# EAGLE design sensor_board (EAGLE 8.1.0)
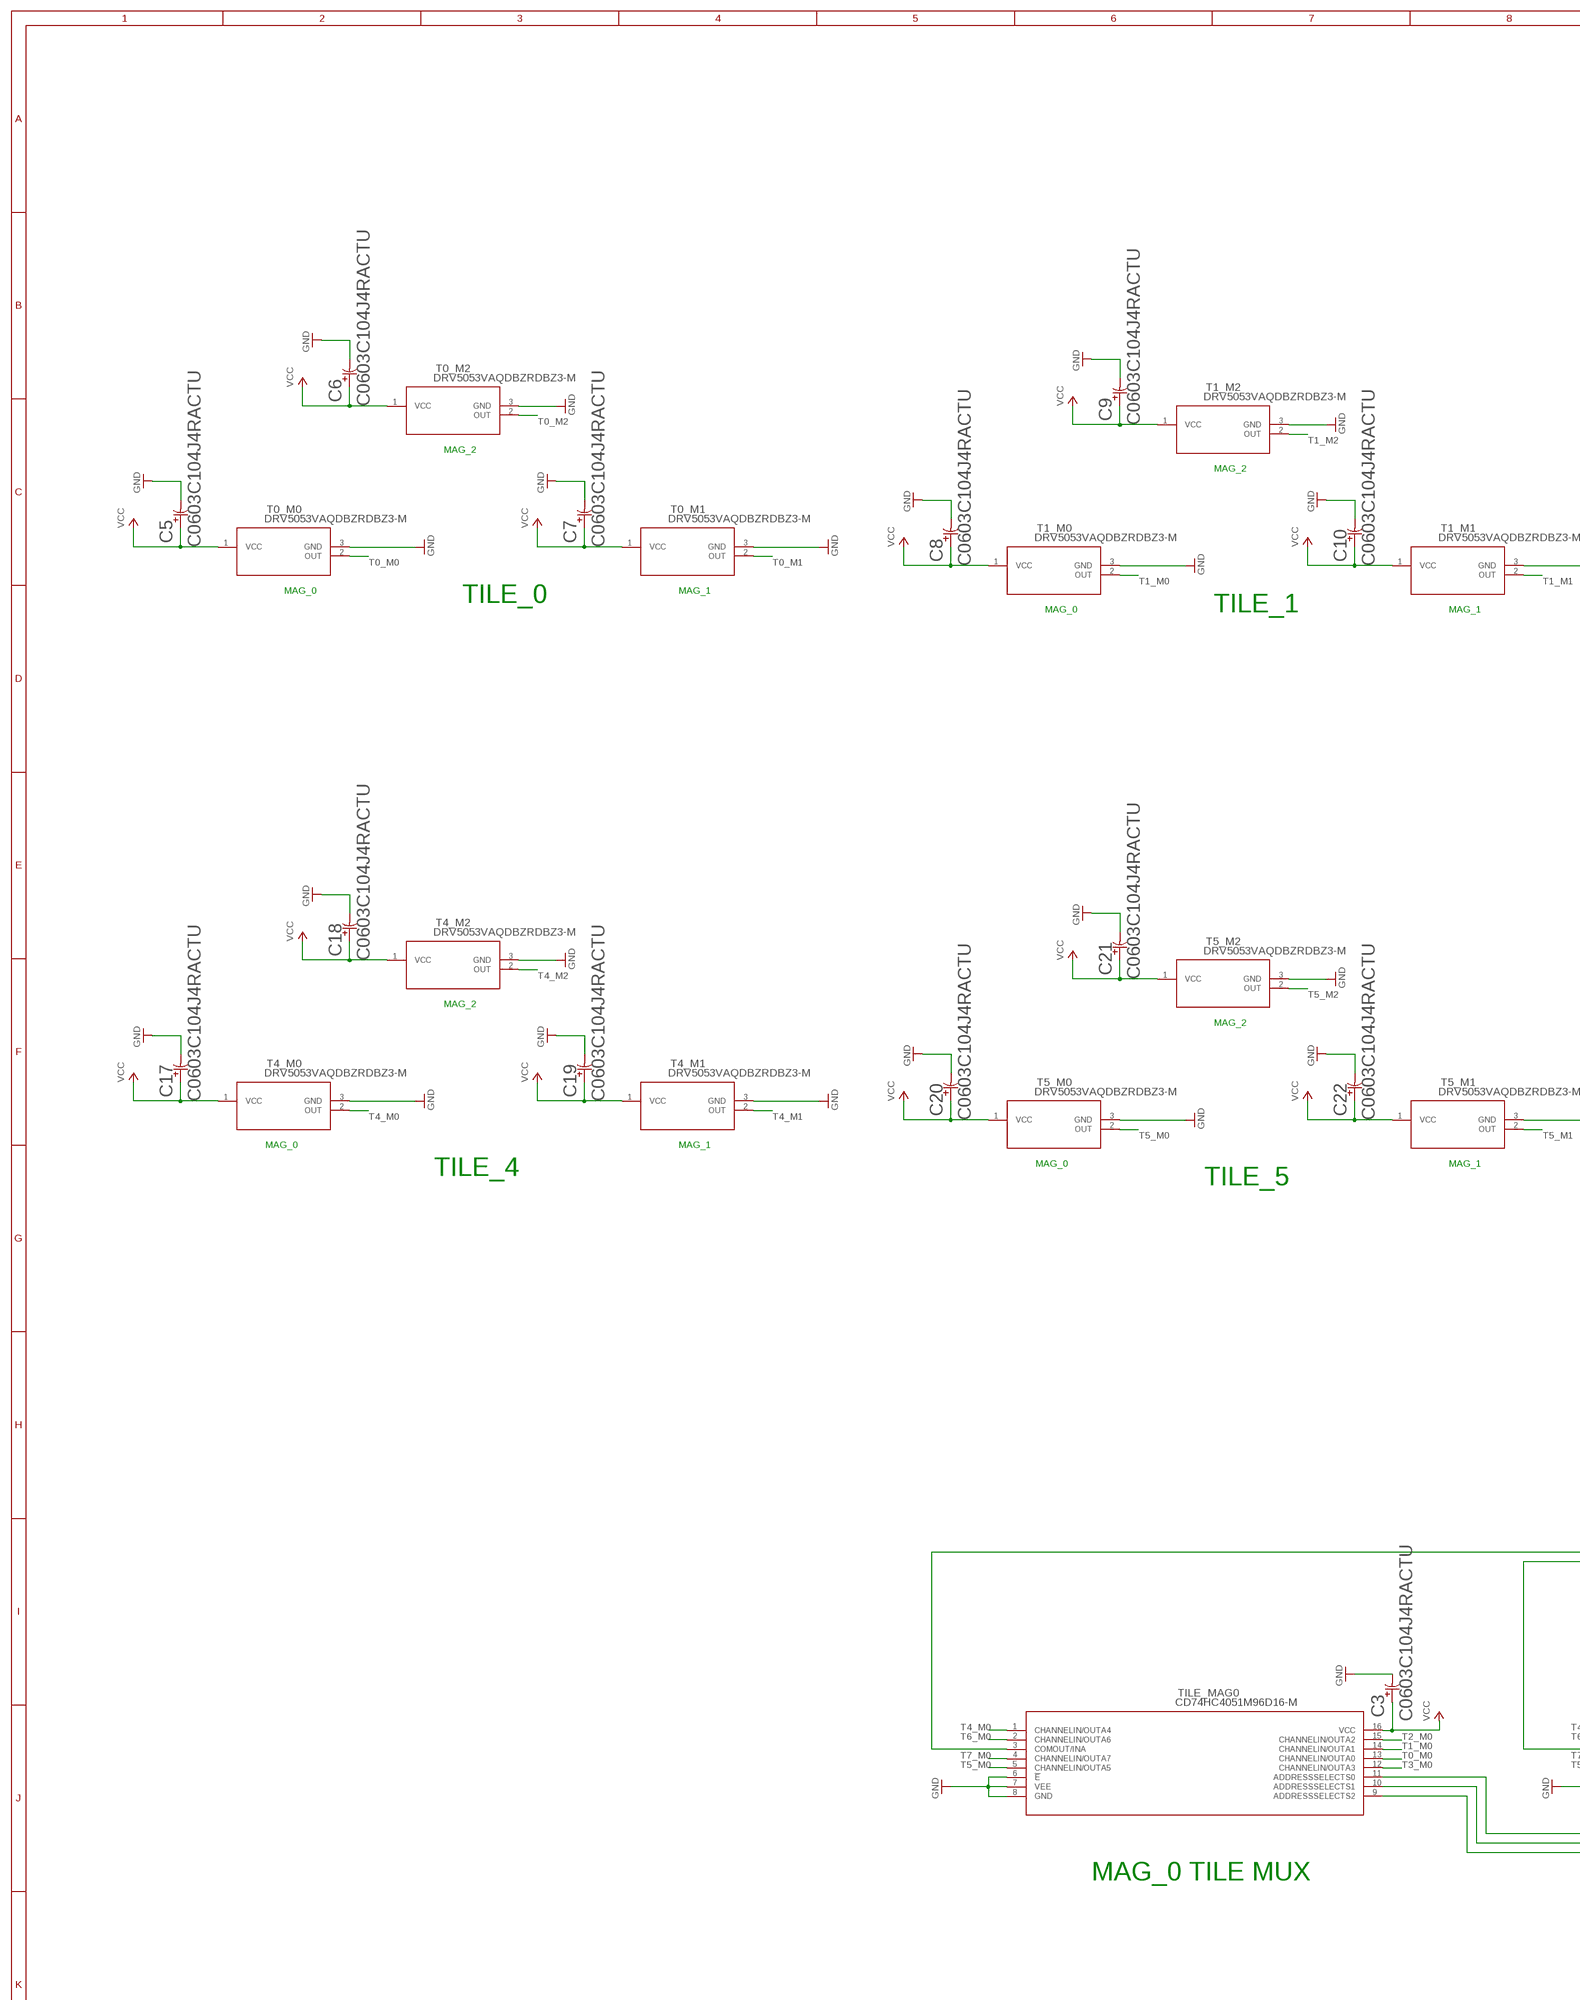
[diagram p0: schematic, sheet 1, part 1 of 3]
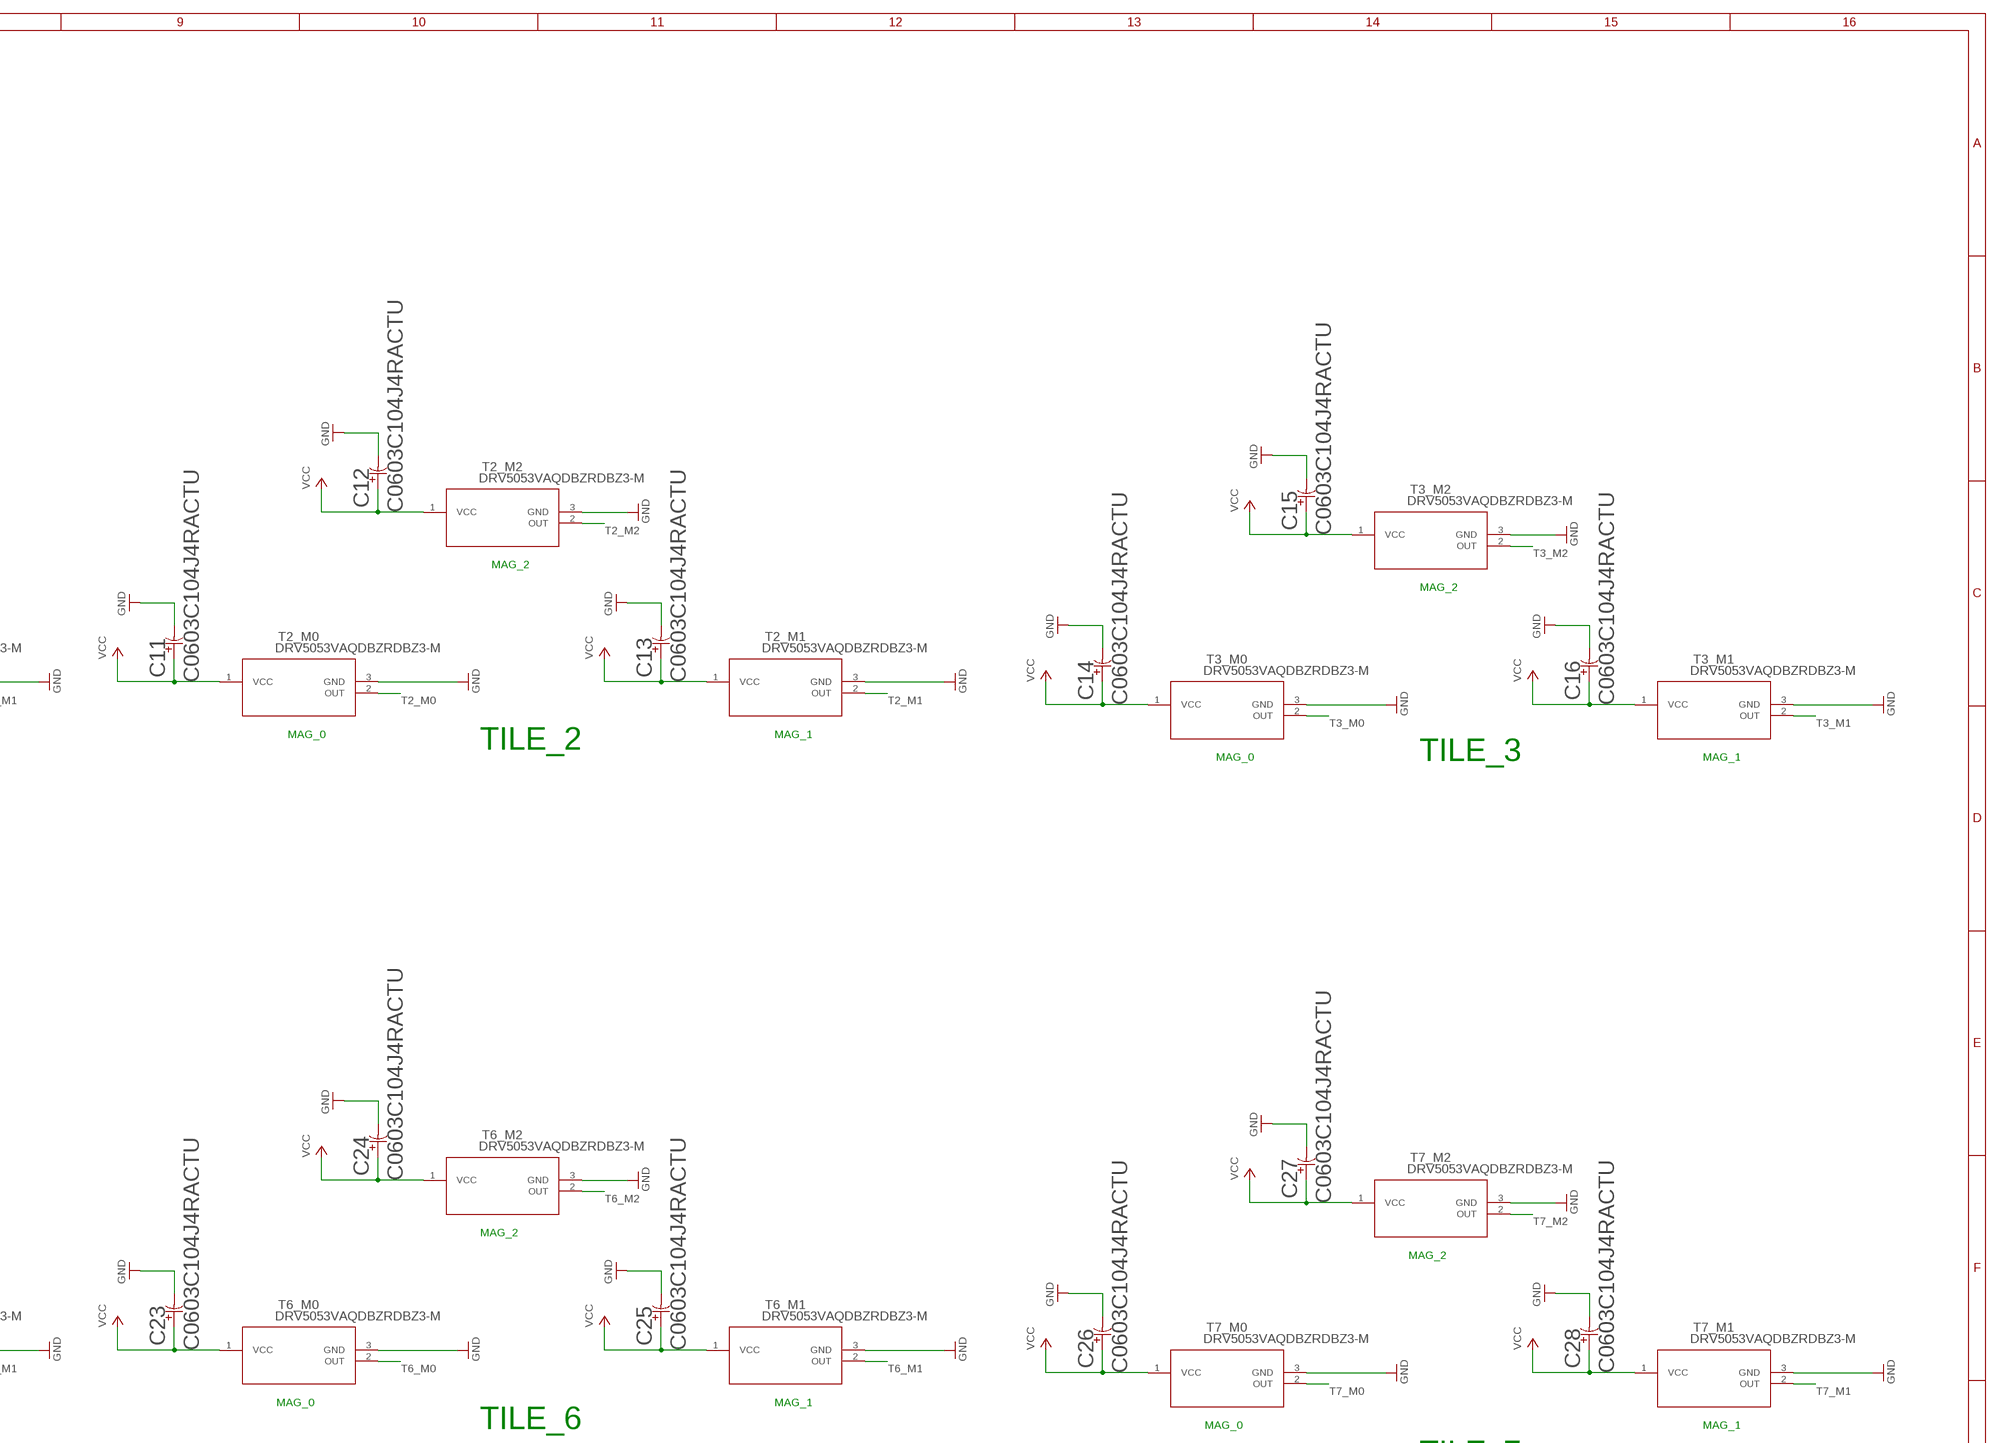
[diagram p1: schematic, sheet 1, part 2 of 3]
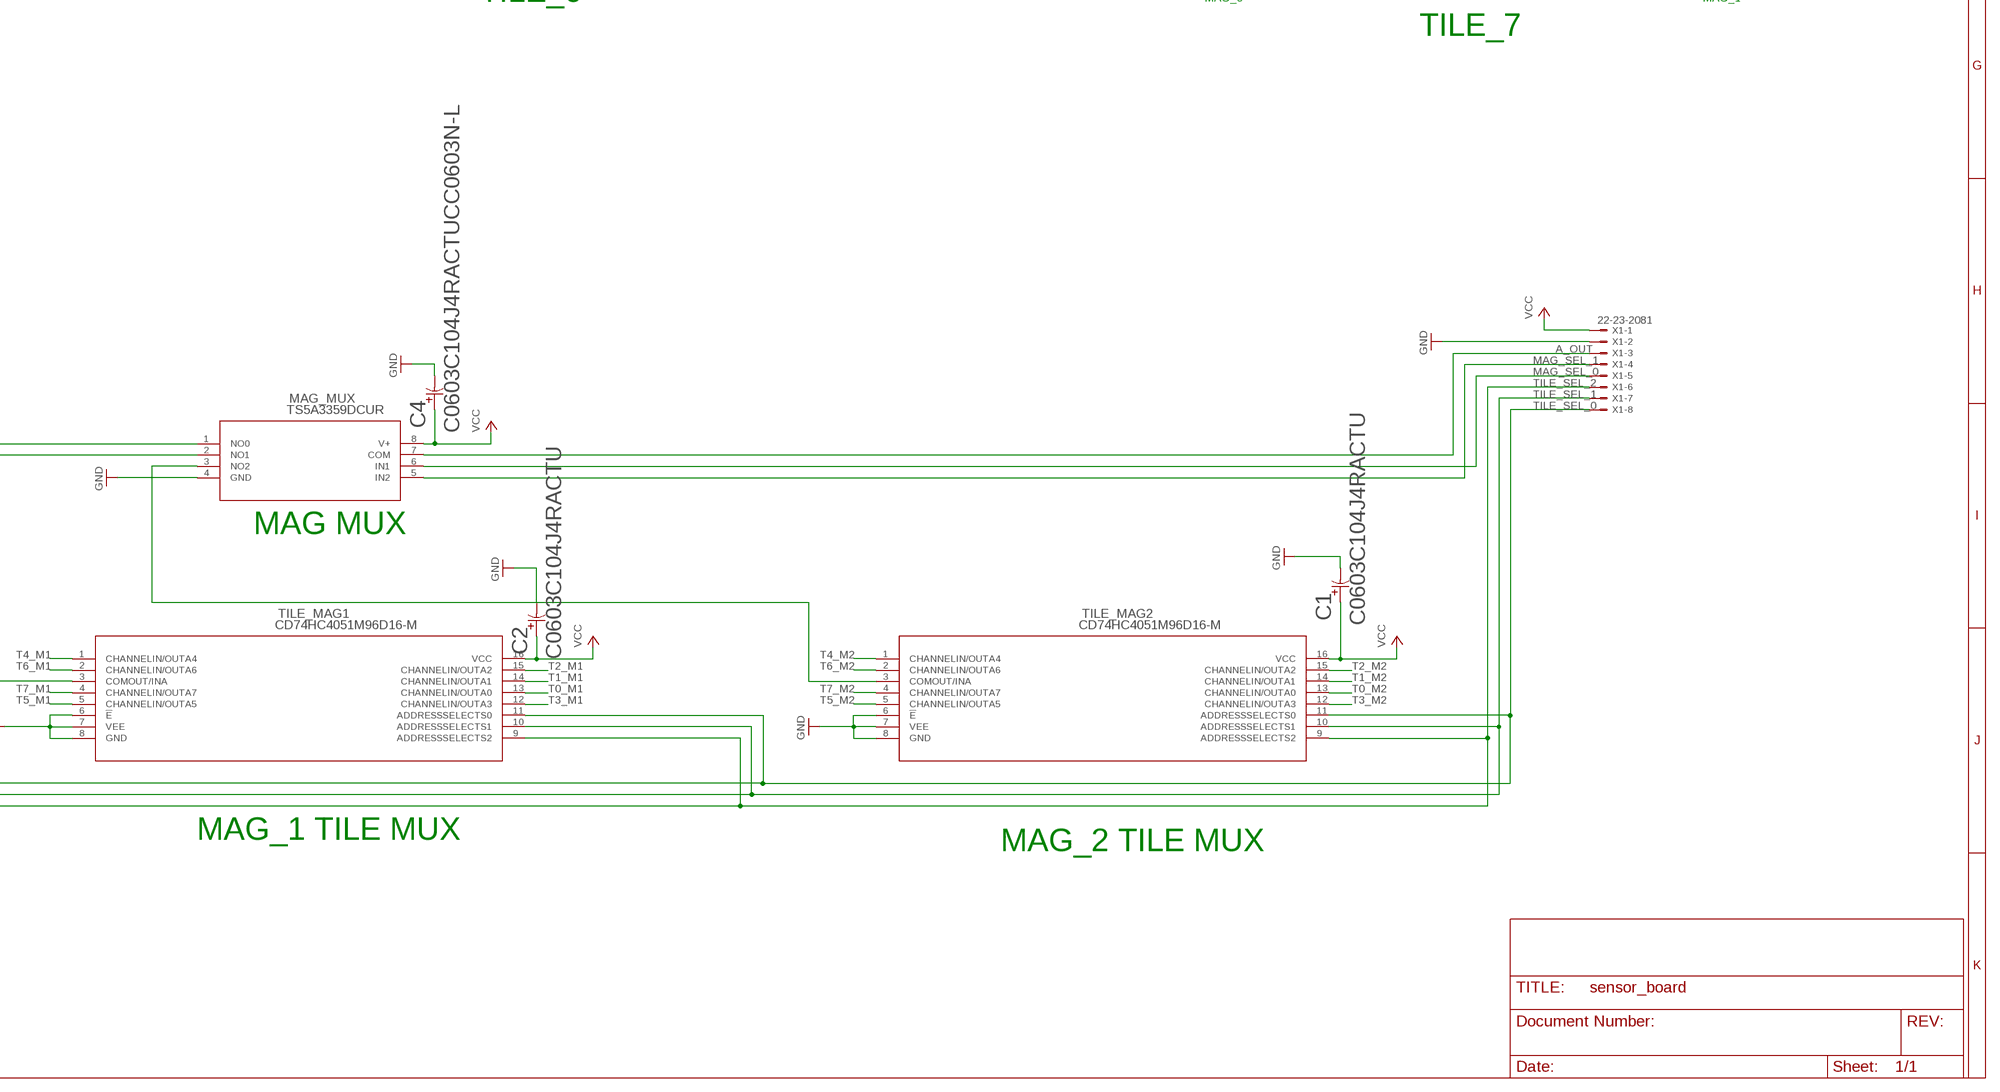
[diagram p2: schematic, sheet 1, part 3 of 3]

## Parts
C1  C0603C104J4RACTU  [CC0603N]
C2  C0603C104J4RACTU  [CC0603N]
C3  C0603C104J4RACTU  [CC0603N]
C4  C0603C104J4RACTUCC0603N-L  [CC0603N-L]
C5  C0603C104J4RACTU  [CC0603N]
C6  C0603C104J4RACTU  [CC0603N]
C7  C0603C104J4RACTU  [CC0603N]
C8  C0603C104J4RACTU  [CC0603N]
C9  C0603C104J4RACTU  [CC0603N]
C10  C0603C104J4RACTU  [CC0603N]
C11  C0603C104J4RACTU  [CC0603N]
C12  C0603C104J4RACTU  [CC0603N]
C13  C0603C104J4RACTU  [CC0603N]
C14  C0603C104J4RACTU  [CC0603N]
C15  C0603C104J4RACTU  [CC0603N]
C16  C0603C104J4RACTU  [CC0603N]
C17  C0603C104J4RACTU  [CC0603N]
C18  C0603C104J4RACTU  [CC0603N]
C19  C0603C104J4RACTU  [CC0603N]
C20  C0603C104J4RACTU  [CC0603N]
C21  C0603C104J4RACTU  [CC0603N]
C22  C0603C104J4RACTU  [CC0603N]
C23  C0603C104J4RACTU  [CC0603N]
C24  C0603C104J4RACTU  [CC0603N]
C25  C0603C104J4RACTU  [CC0603N]
C26  C0603C104J4RACTU  [CC0603N]
C27  C0603C104J4RACTU  [CC0603N]
C28  C0603C104J4RACTU  [CC0603N]
MAG_MUX  TS5A3359DCUR  [DCU8]
T0_M0  DRV5053VAQDBZRDBZ3-M  [DBZ3-M]
T0_M1  DRV5053VAQDBZRDBZ3-M  [DBZ3-M]
T0_M2  DRV5053VAQDBZRDBZ3-M  [DBZ3-M]
T1_M0  DRV5053VAQDBZRDBZ3-M  [DBZ3-M]
T1_M1  DRV5053VAQDBZRDBZ3-M  [DBZ3-M]
T1_M2  DRV5053VAQDBZRDBZ3-M  [DBZ3-M]
T2_M0  DRV5053VAQDBZRDBZ3-M  [DBZ3-M]
T2_M1  DRV5053VAQDBZRDBZ3-M  [DBZ3-M]
T2_M2  DRV5053VAQDBZRDBZ3-M  [DBZ3-M]
T3_M0  DRV5053VAQDBZRDBZ3-M  [DBZ3-M]
T3_M1  DRV5053VAQDBZRDBZ3-M  [DBZ3-M]
T3_M2  DRV5053VAQDBZRDBZ3-M  [DBZ3-M]
T4_M0  DRV5053VAQDBZRDBZ3-M  [DBZ3-M]
T4_M1  DRV5053VAQDBZRDBZ3-M  [DBZ3-M]
T4_M2  DRV5053VAQDBZRDBZ3-M  [DBZ3-M]
T5_M0  DRV5053VAQDBZRDBZ3-M  [DBZ3-M]
T5_M1  DRV5053VAQDBZRDBZ3-M  [DBZ3-M]
T5_M2  DRV5053VAQDBZRDBZ3-M  [DBZ3-M]
T6_M0  DRV5053VAQDBZRDBZ3-M  [DBZ3-M]
T6_M1  DRV5053VAQDBZRDBZ3-M  [DBZ3-M]
T6_M2  DRV5053VAQDBZRDBZ3-M  [DBZ3-M]
T7_M0  DRV5053VAQDBZRDBZ3-M  [DBZ3-M]
T7_M1  DRV5053VAQDBZRDBZ3-M  [DBZ3-M]
T7_M2  DRV5053VAQDBZRDBZ3-M  [DBZ3-M]
TILE_MAG0  CD74HC4051M96D16-M  [D16-M]
TILE_MAG1  CD74HC4051M96D16-M  [D16-M]
TILE_MAG2  CD74HC4051M96D16-M  [D16-M]
X1  22-23-2081  [22-23-2081]

## Nets
A_OUT: MAG_MUX.7(COM) X1.3
GND: C1.2 C2.2 C3.2 C4.2 C5.2 C6.2 C7.2 C8.2 C9.2 C10.2 C11.2 C12.2 C13.2 C14.2 C15.2 C16.2 C17.2 C18.2 C19.2 C20.2 C21.2 C22.2 C23.2 C24.2 C25.2 C26.2 C27.2 C28.2 MAG_MUX.4(GND) T0_M0.3(GND) T0_M1.3(GND) T0_M2.3(GND) T1_M0.3(GND) T1_M1.3(GND) T1_M2.3(GND) T2_M0.3(GND) T2_M1.3(GND) T2_M2.3(GND) T3_M0.3(GND) T3_M1.3(GND) T3_M2.3(GND) T4_M0.3(GND) T4_M1.3(GND) T4_M2.3(GND) T5_M0.3(GND) T5_M1.3(GND) T5_M2.3(GND) T6_M0.3(GND) T6_M1.3(GND) T6_M2.3(GND) T7_M0.3(GND) T7_M1.3(GND) T7_M2.3(GND) TILE_MAG0.6(!E) TILE_MAG0.7(VEE) TILE_MAG0.8(GND) TILE_MAG1.6(!E) TILE_MAG1.7(VEE) TILE_MAG1.8(GND) TILE_MAG2.6(!E) TILE_MAG2.7(VEE) TILE_MAG2.8(GND) X1.2
MAG_SEL_0: MAG_MUX.6(IN1) X1.5
MAG_SEL_1: MAG_MUX.5(IN2) X1.4
N$1: MAG_MUX.1(NO0) TILE_MAG0.3(COMOUT/INA)
N$2: MAG_MUX.2(NO1) TILE_MAG1.3(COMOUT/INA)
N$3: MAG_MUX.3(NO2) TILE_MAG2.3(COMOUT/INA)
T0_M0: T0_M0.2(OUT) TILE_MAG0.13(CHANNELIN/OUTA0)
T0_M1: T0_M1.2(OUT) TILE_MAG1.13(CHANNELIN/OUTA0)
T0_M2: T0_M2.2(OUT) TILE_MAG2.13(CHANNELIN/OUTA0)
T1_M0: T1_M0.2(OUT) TILE_MAG0.14(CHANNELIN/OUTA1)
T1_M1: T1_M1.2(OUT) TILE_MAG1.14(CHANNELIN/OUTA1)
T1_M2: T1_M2.2(OUT) TILE_MAG2.14(CHANNELIN/OUTA1)
T2_M0: T2_M0.2(OUT) TILE_MAG0.15(CHANNELIN/OUTA2)
T2_M1: T2_M1.2(OUT) TILE_MAG1.15(CHANNELIN/OUTA2)
T2_M2: T2_M2.2(OUT) TILE_MAG2.15(CHANNELIN/OUTA2)
T3_M0: T3_M0.2(OUT) TILE_MAG0.12(CHANNELIN/OUTA3)
T3_M1: T3_M1.2(OUT) TILE_MAG1.12(CHANNELIN/OUTA3)
T3_M2: T3_M2.2(OUT) TILE_MAG2.12(CHANNELIN/OUTA3)
T4_M0: T4_M0.2(OUT) TILE_MAG0.1(CHANNELIN/OUTA4)
T4_M1: T4_M1.2(OUT) TILE_MAG1.1(CHANNELIN/OUTA4)
T4_M2: T4_M2.2(OUT) TILE_MAG2.1(CHANNELIN/OUTA4)
T5_M0: T5_M0.2(OUT) TILE_MAG0.5(CHANNELIN/OUTA5)
T5_M1: T5_M1.2(OUT) TILE_MAG1.5(CHANNELIN/OUTA5)
T5_M2: T5_M2.2(OUT) TILE_MAG2.5(CHANNELIN/OUTA5)
T6_M0: T6_M0.2(OUT) TILE_MAG0.2(CHANNELIN/OUTA6)
T6_M1: T6_M1.2(OUT) TILE_MAG1.2(CHANNELIN/OUTA6)
T6_M2: T6_M2.2(OUT) TILE_MAG2.2(CHANNELIN/OUTA6)
T7_M0: T7_M0.2(OUT) TILE_MAG0.4(CHANNELIN/OUTA7)
T7_M1: T7_M1.2(OUT) TILE_MAG1.4(CHANNELIN/OUTA7)
T7_M2: T7_M2.2(OUT) TILE_MAG2.4(CHANNELIN/OUTA7)
TILE_SEL_0: TILE_MAG0.11(ADDRESSSELECTS0) TILE_MAG1.11(ADDRESSSELECTS0) TILE_MAG2.11(ADDRESSSELECTS0) X1.8
TILE_SEL_1: TILE_MAG0.10(ADDRESSSELECTS1) TILE_MAG1.10(ADDRESSSELECTS1) TILE_MAG2.10(ADDRESSSELECTS1) X1.7
TILE_SEL_2: TILE_MAG0.9(ADDRESSSELECTS2) TILE_MAG1.9(ADDRESSSELECTS2) TILE_MAG2.9(ADDRESSSELECTS2) X1.6
VCC: C1.1 C2.1 C3.1 C4.1 C5.1 C6.1 C7.1 C8.1 C9.1 C10.1 C11.1 C12.1 C13.1 C14.1 C15.1 C16.1 C17.1 C18.1 C19.1 C20.1 C21.1 C22.1 C23.1 C24.1 C25.1 C26.1 C27.1 C28.1 MAG_MUX.8(V+) T0_M0.1(VCC) T0_M1.1(VCC) T0_M2.1(VCC) T1_M0.1(VCC) T1_M1.1(VCC) T1_M2.1(VCC) T2_M0.1(VCC) T2_M1.1(VCC) T2_M2.1(VCC) T3_M0.1(VCC) T3_M1.1(VCC) T3_M2.1(VCC) T4_M0.1(VCC) T4_M1.1(VCC) T4_M2.1(VCC) T5_M0.1(VCC) T5_M1.1(VCC) T5_M2.1(VCC) T6_M0.1(VCC) T6_M1.1(VCC) T6_M2.1(VCC) T7_M0.1(VCC) T7_M1.1(VCC) T7_M2.1(VCC) TILE_MAG0.16(VCC) TILE_MAG1.16(VCC) TILE_MAG2.16(VCC) X1.1

## Notes on the sheet
- MAG_2
- MAG_2 | MAG_2
- MAG_2
- MAG_0 | MAG_1
- TILE_0
- MAG_0 | TILE_1 | MAG_1 | MAG_0 | MAG_1
- TILE_2
- MAG_0 | TILE_3 | MAG_1
- MAG_2
- MAG_2 | MAG_2
- MAG_2
- MAG_0 | MAG_1
- MAG_0 | MAG_1 | MAG_0 | MAG_1
- TILE_4
- TILE_5 | TILE_6 | MAG_0 | MAG_1
- TILE_7
- MAG MUX
- MAG_0 TILE MUX | MAG_1 TILE MUX
- MAG_2 TILE MUX

## Library data of the parts
C1-C28 = senior_project_01uf_cap:C0603C104J4RACTU; MANUFACTURER_PART_NUMBER: C0603C104J4RACTU; VENDOR: Kemet
MAG_MUX = senior_project_3-1_mux:TS5A3359DCUR; MANUFACTURER_PART_NUMBER: TS5A3359DCUR; VENDOR: Texas Instruments
T0_M0 T0_M1 T0_M2 T1_M0 T1_M1 T1_M2 T2_M0 T2_M1 T2_M2 T3_M0 T3_M1 T3_M2 T4_M0 T4_M1 T4_M2 T5_M0 T5_M1 T5_M2 T6_M0 T6_M1 T6_M2 T7_M0 T7_M1 T7_M2 = senior_project_hall-effect-sensor:DRV5053VAQDBZR; MANUFACTURER_PART_NUMBER: drv5053vaqdbzr; VENDOR: Texas Instruments
TILE_MAG0 TILE_MAG1 TILE_MAG2 = senior_proj_8-1_mux:CD74HC4051M96; MANUFACTURER_PART_NUMBER: CD74HC4051M96; VENDOR: Texas Instruments
X1 = con-molex:22-23-2081: .100" (2.54mm) Center Header - 8 Pin; MF: MOLEX; MPN: 22-23-2081; OC_FARNELL: 1756826; OC_NEWARK: 01C7592

## Board
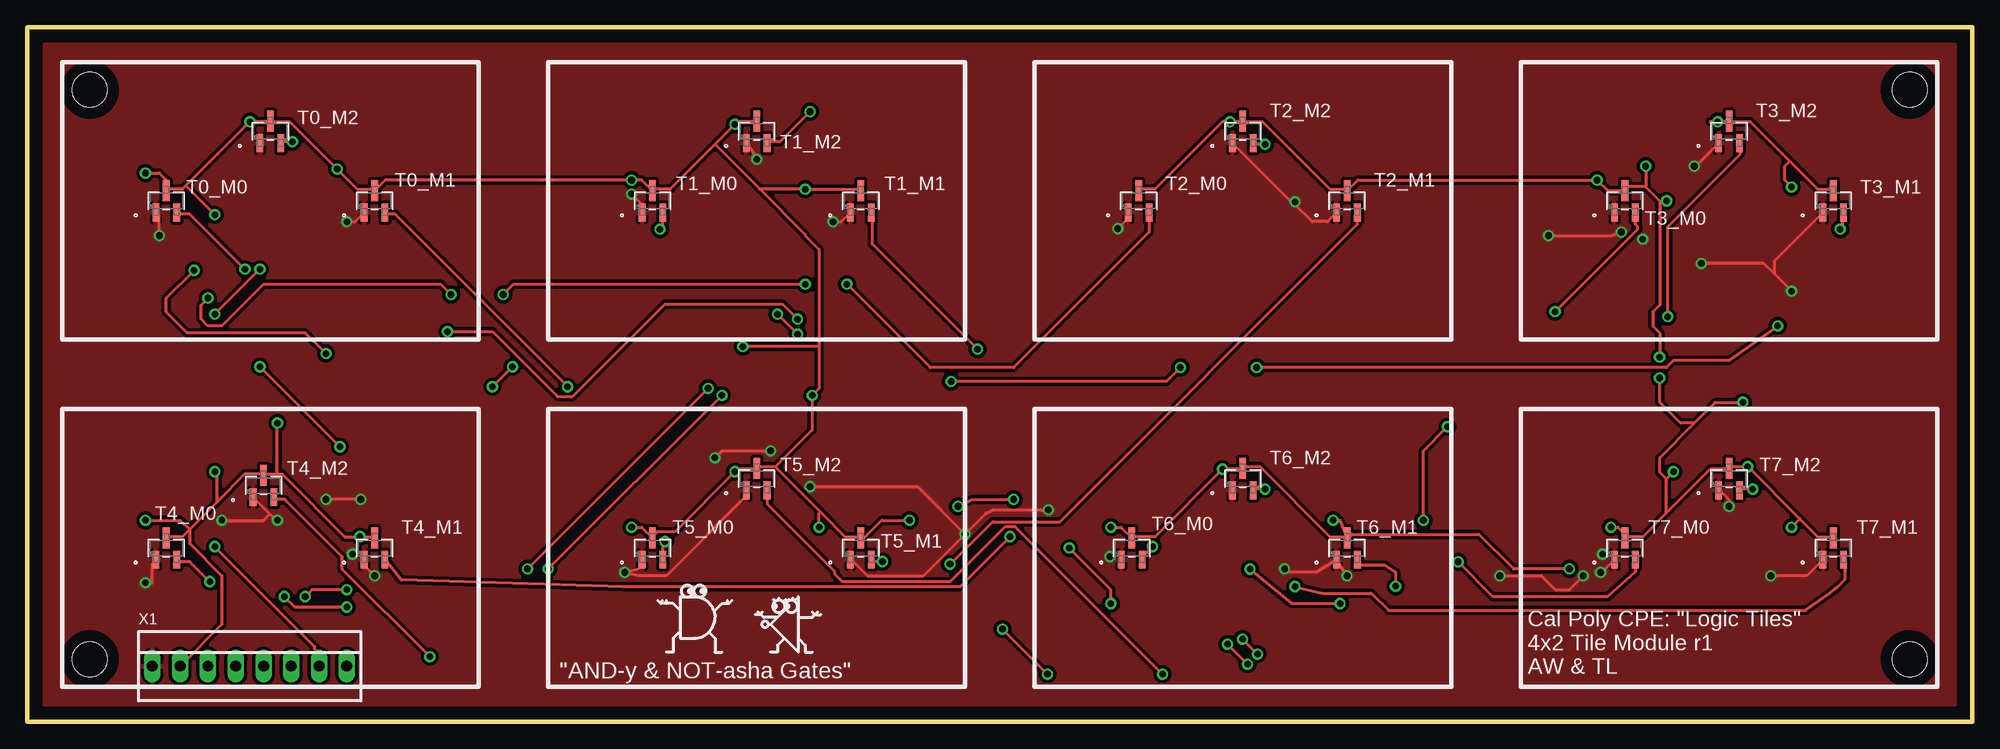
[diagram p3: board, top side]
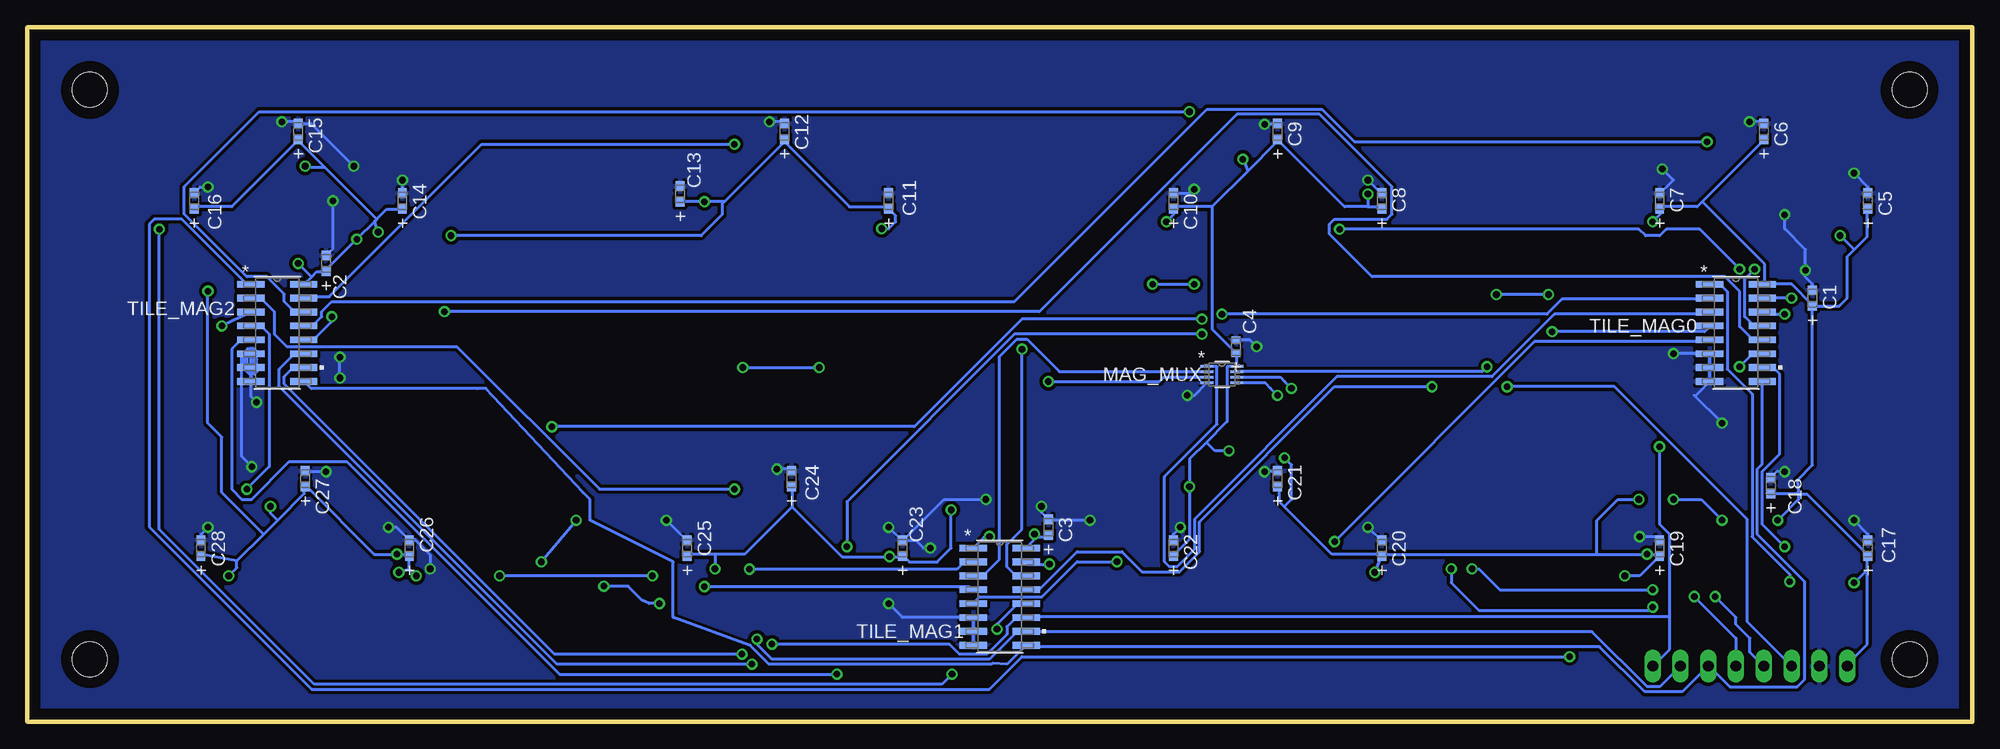
[diagram p4: board, bottom side, seen from below]

Size 177.8 x 63.5 mm. Coordinates in mm from the lower left corner, seen from the top.
Outline: 0,0 177.8,0 177.8,63.5 0,63.5 0,0
Copper layers (1*16): Top 0.035mm / dielectric 1.5mm / Bottom 0.035mm
Design rules "default": minimum track width 10mil, minimum drill 24mil, track to track 8mil, track to pad 8mil, pad to pad 8mil, via to via 8mil, smd to smd 8mil, copper to edge 40mil, drill to drill 8mil, minimum pad ring 10mil, minimum via ring 8mil, stop-mask expansion 4mil, vias tented up to drill 0mil, thermal gap 10mil
Holes 3.2 mm at 5.71,57.78 5.71,5.71 172.09,57.78 172.09,5.71

### Footprints (pad centres in the part's own frame; a part is rotated, then mirrored left to right if it is on the bottom)
CC0603N = smd 0.864 x 0.813: 1 -0.724,0; 2 0.724,0
CC0603N-L = smd 0.66 x 0.813: 1 -0.622,0; 2 0.622,0
DCU8 = smd 1.168 x 0.254: 1 -1.372,0.75; 2 -1.372,0.25; 3 -1.372,-0.25; 4 -1.372,-0.75; 5 1.372,-0.75; 6 1.372,-0.25; 7 1.372,0.25; 8 1.372,0.75
DBZ3-M = smd 0.61 x 1.626: 1 -0.95,-1.067; 2 0.95,-1.067 | smd 0.61 x 1.892: 3 0,0.933
D16-M = smd 2.489 x 0.61: 1 -2.413,4.445; 2 -2.413,3.175; 3 -2.413,1.905; 4 -2.413,0.635; 5 -2.413,-0.635; 6 -2.413,-1.905; 7 -2.413,-3.175; 8 -2.413,-4.445; 9 2.413,-4.445; 10 2.413,-3.175; 11 2.413,-1.905; 12 2.413,-0.635; 13 2.413,0.635; 14 2.413,1.905; 15 2.413,3.175; 16 2.413,4.445
22-23-2081 = drill 1 long: 1 -8.89,0; 2 -6.35,0; 3 -3.81,0; 4 -1.27,0; 5 1.27,0; 6 3.81,0; 7 6.35,0; 8 8.89,0

### Placement (x,y rotation side)
C1  14.61,38.73 90 bottom
C2  150.5,41.91 90 bottom
C3  84.45,17.78 90 bottom
C4  67.31,34.29 90 bottom
C5  9.53,47.62 90 bottom
C6  19.05,53.98 90 bottom
C7  28.57,47.62 90 bottom
C8  53.98,47.62 90 bottom
C9  63.5,53.98 90 bottom
C10  73.03,47.62 90 bottom
C11  99.06,47.62 90 bottom
C12  108.58,53.98 90 bottom
C13  118.11,48.26 90 bottom
C14  143.51,47.62 90 bottom
C15  153.03,53.98 90 bottom
C16  162.56,47.62 90 bottom
C17  9.53,15.88 90 bottom
C18  18.41,21.59 90 bottom
C19  28.57,15.88 90 bottom
C20  53.98,15.88 90 bottom
C21  63.5,22.23 90 bottom
C22  73.03,15.88 90 bottom
C23  97.79,15.88 90 bottom
C24  107.95,22.23 90 bottom
C25  117.47,15.88 90 bottom
C26  142.88,15.88 90 bottom
C27  152.4,22.23 90 bottom
C28  161.93,15.88 90 bottom
MAG_MUX  68.58,31.75 0 bottom
T0_M0  12.7,47.62 0 top
T0_M1  31.75,47.62 0 top
T0_M2  22.23,53.98 0 top
T1_M0  57.15,47.62 0 top
T1_M1  76.2,47.62 0 top
T1_M2  66.67,53.98 0 top
T2_M0  101.6,47.62 0 top
T2_M1  120.65,47.62 0 top
T2_M2  111.12,53.98 0 top
T3_M0  146.05,47.62 0 top
T3_M1  165.1,47.62 0 top
T3_M2  155.57,53.98 0 top
T4_M0  12.7,15.88 0 top
T4_M1  31.75,15.88 0 top
T4_M2  21.59,21.59 0 top
T5_M0  57.15,15.88 0 top
T5_M1  76.2,15.88 0 top
T5_M2  66.67,22.23 0 top
T6_M0  100.97,15.88 0 top
T6_M1  120.65,15.88 0 top
T6_M2  111.12,22.23 0 top
T7_M0  146.05,15.88 0 top
T7_M1  165.1,15.88 0 top
T7_M2  155.57,22.23 0 top
TILE_MAG0  21.59,35.56 0 bottom
TILE_MAG1  88.9,11.43 0 bottom
TILE_MAG2  154.94,35.56 0 bottom
X1  20.32,5.08 0 top

### Tracks (layer width: path | path; a pad name or v marks a point on that pad's centre or on a via)
A_OUT  (via drill 0.61)
  Top 0.254: v42.52,30.63 v44.35,32.46
  Bottom 0.254: v44.35,32.46 44.81,32 MAG_MUX.7 | v42.52,30.63 32.69,30.63 20.57,18.52 20.57,9.14 X1.3
GND  (via drill 0.61, 0.61 pad 1.02)
  Top 0.254: 153.85,54.86 v154.53,54.86 155.45,54.86 T3_M2.3 155.68,54.86 157.5,54.86 161.11,51.26 | T3_M0.3 146.07,48.69 | 161.11,51.26 163.68,48.69 165.05,48.69 T3_M1.3 | T2_M0.3 101.73,48.69 103.1,48.69 109.27,54.86 v109.96,54.86 111.1,54.86 T2_M2.3 111.33,54.86 112.93,54.86 119.1,48.69 120.47,48.69 T2_M1.3 121.62,49.53 v143.51,49.53 144.48,48.56 T3_M0.3 | 62.87,52.81 v64.69,54.63 64.92,54.86 66.52,54.86 T1_M2.3 | 62.87,52.81 58.75,48.69 57.15,48.69 T1_M0.3 56.18,49.53 v55.24,49.53 32.72,49.53 T0_M1.3 31.55,48.69 30.18,48.69 v28.32,50.55 24,54.86 22.4,54.86 T0_M2.3 22.17,54.86 v20.34,54.86 14.49,49.01 | 66.98,48.69 v71.12,48.69 76.12,48.69 T1_M1.3 | 62.87,52.81 66.98,48.69 | 72.5,19.16 74.75,16.92 76.12,16.92 T5_M1.3 76.5,16.81 78.11,18.41 v80.64,18.41 | 72.5,19.16 68.35,23.32 | 68.35,23.32 66.75,23.32 T5_M2.3 66.52,23.09 64.92,23.09 v64.69,22.86 59.21,17.37 57.61,17.37 57.15,16.92 T5_M0.3 56.18,17.78 v55.24,17.78 | 14.49,49.01 14.17,48.69 12.8,48.69 T0_M0.3 12.7,49.53 12.06,50.16 v10.79,50.16 | 17.36,20.1 19.89,22.63 21.49,22.63 T4_M2.3 21.72,22.63 22.86,22.63 | 17.36,20.1 14.82,17.56 | 14.82,17.56 14.17,16.92 12.8,16.92 T4_M0.3 | 22.86,22.63 23.32,22.63 29.03,16.92 v30.4,16.92 31.55,16.92 T4_M1.3 | 149.84,19.07 153.85,23.09 155.45,23.09 T7_M2.3 155.68,23.32 v157.28,23.32 162.05,18.54 | 149.84,19.07 147.68,16.92 146.07,16.92 T7_M0.3 146.05,17.14 145.41,17.78 v144.78,17.78 | 162.05,18.54 163.68,16.92 165.05,16.92 T7_M1.3 | v140.97,13.97 135.89,13.97 132.72,17.14 120.99,17.14 120.65,17.14 | 147.92,48.93 149.22,47.62 | 149.22,47.62 v149.86,47.62 | 149.84,19.07 149.84,22.2
  Top 0.254: 149.84,22.2 v150.5,22.86 | 68.35,23.32 68.4,23.32 71.75,26.67 v71.75,29.84 72.39,30.48 72.39,34.29 | 14.49,49.01 v17.14,46.35 | 22.86,22.63 v22.86,27.3 | v72.39,17.78 72.39,19.05 72.5,19.16 | v119.38,18.41 120.02,18.41 T6_M1.3 120.47,16.92 119.1,16.92 112.7,23.32 111.33,23.32 T6_M2.3 111.1,23.09 v109.27,23.09 103.1,16.92 101.04,16.92 T6_M0.3 99.99,17.78 v99.06,17.78 | 149.84,22.2 149.22,22.81 149.22,24.13 152.4,27.3 | 152.4,27.3 154.31,29.21 v156.84,29.21 | 162.05,18.54 v161.29,17.78 | v161.29,48.9 160.66,49.53 160.66,50.8 161.11,51.26 | 66.98,48.69 71.12,44.55 71.12,44.45 72.39,43.18 72.39,34.29 | 72.39,34.29 v65.41,34.29 | 17.36,20.1 17.36,22.64 v17.14,22.86 | v27.3,33.66 25.4,35.56 14.61,35.56 12.7,37.47 12.7,38.73 v15.24,41.27 | v10.79,18.41 13.97,18.41 14.82,17.56 | 14.82,17.56 14.82,16.29 17.78,13.34 17.78,8.89 X1.2 | v99.06,10.79 99.06,12.06 v95.25,15.88 | 152.4,27.3 151.13,27.3 149.22,29.21 v149.22,31.43 | v149.22,33.34 149.22,35.56 148.59,36.2 148.59,37.47 149.22,38.1 149.22,47.62 | 147.92,48.93 146.05,48.93 T3_M0.3 | v147.96,50.8 147.96,48.97 147.92,48.93 | v85.09,19.68 86.36,20.32 v90.17,20.32
  Top 0.406: T6_M1.3 120.99,17.14
  Bottom 0.254: v30.4,16.92 28.8,16.92 28.57,16.69 C19.2 | v157.28,23.32 158.19,24.23 158.19,33.83 157.96,33.83 157.96,32.69 157.73,32.46 157.73,32.23 157.5,32 157.28,32 157.05,31.77 156.82,32 156.82,33.15 157.05,33.38 156.82,33.6 156.82,33.83 157.05,34.06 157.73,34.06 157.73,32.69 157.96,32.46 157.96,32.23 157.5,31.77 157.28,31.77 157.05,32 157.05,33.15 156.82,33.38 157.05,33.6 157.28,33.6 TILE_MAG2.6 TILE_MAG2.7 TILE_MAG2.8 157.35,29.72 v156.84,29.21 | v20.34,54.86 19.2,54.86 C6.2 | v64.69,22.86 63.55,22.86 C21.2 | v64.69,54.63 63.55,54.63 C9.2 | v109.96,54.86 108.58,54.86 C12.2 | v154.53,54.86 153.16,54.86 C15.2 151.85,54.7 v147.96,50.8 | v109.27,23.09 108.13,23.09 C24.2 | v140.97,13.97 140.97,15.24 142.33,16.6 C26.2 144.06,17.78 v144.78,17.78 | C2.2 149.86,43.27 v149.86,47.62 | 152.31,22.86 C27.2 152.4,22.86 v150.5,22.86 | C14.2 v143.51,49.53 | C8.2 54.06,48.35 v55.24,49.53 | C10.2 71.46,48.35 v71.12,48.69 | v71.75,29.84 71.11,29.84 MAG_MUX.4 | C5.2 9.53,48.9 v10.79,50.16 | v22.86,27.3 25.4,29.84 25.27,29.84 TILE_MAG0.8 TILE_MAG0.7 TILE_MAG0.6 v27.3,33.66 | TILE_MAG1.8 TILE_MAG1.7 TILE_MAG1.6 97.79,9.53 v99.06,10.79 | C22.2 73.03,17.14 v72.39,17.78 | v80.64,18.41 84.37,18.41 C3.2 85.09,19.14 v85.09,19.68 | C20.2 54.06,16.6 v55.24,17.78 | C25.2 117.56,16.6 v119.38,18.41 | v161.29,17.78 161.93,17.14 C28.2 | C16.2 162.01,48.9 v161.29,48.9 | v65.41,34.29 66.03,34.91 C4.2 | v17.14,22.86 17.87,22.86 C18.2 | C7.2 28.49,48.35 27.3,49.53 v28.32,50.55 | C17.2 9.53,17.14 v10.79,18.41 | v95.25,15.88 95.89,15.88 96.52,16.51 97.7,16.51 C23.2 | C23.2 97.88,16.6 v99.06,17.78 | C23.2 97.7,16.6 93.98,20.32 v90.17,20.32
  Bottom 0.254: v149.22,31.43 v149.22,33.34 | C1.2 14.61,40.01 15.24,40.64 v15.24,41.27 15.24,43.18 17.14,45.09 v17.14,46.35
  pour Bottom (isolate 0.305): 0,0 0,63.5 177.8,63.5 177.8,0
MAG_SEL_0  (via drill 0.61 pad 1.02)
  Top 0.254: v62.23,30.48 57.78,26.04 v45.72,13.97 | v29.21,12.06 26.04,12.06 v25.4,11.43
  Bottom 0.254: MAG_MUX.6 63.25,31.5 62.87,31.11 v62.23,30.48 | v45.72,13.97 45.09,13.97 43.18,12.06 v29.21,12.06 | v25.4,11.43 21.59,7.62 X1.5
MAG_SEL_1  (via drill 0.61 pad 1.02)
  Top 0.254: v63.5,29.84 v47.62,13.97 | v23.5,11.43 24.45,10.48 v29.21,10.48
  Bottom 0.254: MAG_MUX.5 64.66,31 64.14,30.48 v63.5,29.84 | v47.62,13.97 47.62,12.7 45.09,10.16 29.53,10.16 v29.21,10.48 | X1.4 20.32,6.35 20.32,7.62 21.59,8.89 21.59,9.53 v23.5,11.43
N$1
  Bottom 0.254: MAG_MUX.1 69.95,32.46 69.04,32.46 69.04,27.2 73.84,22.4 73.84,14.63 73.38,14.17 72.69,14.17 71.09,15.77 71.09,18.52 58.06,31.55 43.89,31.55 38.18,37.26 24,37.26 TILE_MAG0.3
N$2
  Bottom 0.254: MAG_MUX.2 83.44,32 86.41,34.98 87.33,34.98 88.92,33.38 88.92,14.86 90.3,13.49 91.21,13.49 TILE_MAG1.3
N$3  (via drill 0.61 pad 1.02)
  Top 0.254: v160.02,36.2 155.57,33.02 150.5,33.02 149.86,32.38 v112.39,32.38 | v105.41,32.38 104.14,31.11 v84.45,31.11
  Bottom 0.254: TILE_MAG2.3 v160.02,36.2 | v112.39,32.38 v105.41,32.38 | v84.45,31.11 74.3,31.11 73.91,31.5 MAG_MUX.3
T0_M0  (via drill 0.61)
  Top 0.254: v19.89,41.38 14.86,46.41 13.72,46.41 T0_M0.2
  Bottom 0.254: v19.89,41.38 20.8,40.46 20.8,37.03 20.12,36.35 19.2,36.35 TILE_MAG0.13
T0_M1  (via drill 0.61)
  Top 0.254: v49.38,30.63 33.6,46.41 32.92,46.41 T0_M1.2
  Bottom 0.254: v49.38,30.63 58.29,30.63 70.64,18.29 70.64,15.54 72.47,13.72 75.89,13.72 77.72,15.54 81.84,15.54 85.27,12.12 86.41,12.12 TILE_MAG1.13
T0_M2  (via drill 0.61)
  Top 0.254: v24.23,53.03 23.32,53.03 T0_M2.2
  Bottom 0.254: v24.23,53.03 56.46,53.03 59.44,56.01 69.95,56.01 87.55,38.41 149.96,38.41 150.88,37.49 150.88,37.03 151.56,36.35 152.48,36.35 TILE_MAG2.13
T1_M0  (via drill 0.61)
  Top 0.254: v57.84,45.03 58.06,45.26 58.06,46.41 T1_M0.2 | v17.14,37.26 v21.26,41.38
  Bottom 0.254: v57.84,45.03 30.48,45.03 29.84,44.45 28.57,44.45 27.94,45.03 24.92,45.03 v21.26,41.38 | v17.14,37.26 18.97,37.26 TILE_MAG0.14
T1_M1  (via drill 0.61)
  Top 0.254: v86.87,34.06 77.27,43.66 77.27,46.41 T1_M1.2
  Bottom 0.254: v86.87,34.06 86.87,17.6 88.24,16.23 88.24,14.17 87.55,13.49 86.64,13.49 TILE_MAG1.14
T1_M2  (via drill 0.61)
  Top 0.254: v71.55,55.78 68.81,53.03 67.67,53.03 T1_M2.2
  Bottom 0.254: v71.55,55.78 156.59,55.78 163.45,48.92 163.45,46.41 157.73,40.69 155.91,40.69 154.31,39.09 154.31,38.41 153.39,37.49 152.71,37.49 TILE_MAG2.14
T2_M0  (via drill 0.61, 0.61 pad 1.02)
  Top 0.254: T2_M0.2 102.55,44.77 90.17,32.38 82.55,32.38 v74.93,40.01 | v16.51,38.73 15.88,38.1 15.88,36.83 16.51,36.2 17.78,36.2 21.59,40.01 37.78,40.01 v38.73,39.05 | v71.12,40.01 44.45,40.01 v43.5,39.05
  Bottom 0.254: v74.93,40.01 v71.12,40.01 | v16.51,38.73 TILE_MAG0.15 | v38.73,39.05 v43.5,39.05
T2_M1  (via drill 0.61)
  Top 0.254: v84.35,14.4 88.24,18.29 94.41,18.29 121.61,45.49 121.61,46.41 T2_M1.2
  Bottom 0.254: v84.35,14.4 86.41,14.4 TILE_MAG1.15
T2_M2  (via drill 0.61)
  Top 0.254: v113.16,52.81 112.24,52.81 T2_M2.2
  Bottom 0.254: v113.16,52.81 136.25,52.81 150.19,38.86 152.48,38.86 TILE_MAG2.15
T3_M0  (via drill 0.61)
  Top 0.254: v139.68,37.49 147.22,45.03 147.22,45.26 146.99,45.49 146.99,46.41 T3_M0.2
  Bottom 0.254: v139.68,37.49 85.27,37.49 67.21,55.55 59.66,55.55 53.03,48.92 53.03,46.41 53.49,45.95 58.29,45.95 58.75,45.49 58.75,44.58 54.86,40.69 22.63,40.69 21.26,39.32 21.26,36.12 20.12,34.98 19.2,34.98 TILE_MAG0.12
T3_M1  (via drill 0.61)
  Top 0.254: v165.74,45.03 165.96,45.26 165.96,46.41 T3_M1.2 | v89.15,8.46 v93.27,4.34
  Bottom 0.254: v165.74,45.03 165.74,17.6 151.56,3.43 94.18,3.43 v93.27,4.34 | v89.15,8.46 89.15,8.91 87.33,10.74 86.64,10.74 TILE_MAG1.12
T3_M2  (via drill 0.61)
  Top 0.254: v149.96,37.03 149.96,45.26 156.59,51.89 156.59,52.81 T3_M2.2
  Bottom 0.254: v149.96,37.03 149.96,36.58 151.56,34.98 152.48,34.98 TILE_MAG2.12
T4_M0  (via drill 0.61)
  Top 0.254: v16.69,12.8 14.86,14.63 13.72,14.63 T4_M0.2
  Bottom 0.254: v16.69,12.8 16.69,13.49 20.12,16.92 20.12,29.95 22.4,32.23 22.4,39.32 23.09,40.01 TILE_MAG0.1
T4_M1  (via drill 0.61)
  Top 0.254: v89.84,16.92 85.27,12.34 55.78,12.34 54.53,12.32 34.19,12.95 T4_M1.2
  Bottom 0.254: v89.84,16.92 90.3,16.92 91.21,16 TILE_MAG1.1
T4_M2  (via drill 0.61)
  Top 0.254: v36.8,5.94 28.8,13.95 28.8,15.09 23.55,20.34 22.63,20.34 T4_M2.2
  Bottom 0.254: v36.8,5.94 86.87,5.94 89.84,2.97 151.79,2.97 166.65,17.83 166.65,45.49 166.19,45.95 163.68,45.95 157.73,40.01 TILE_MAG2.1
T5_M0  (via drill 0.61)
  Top 0.254: v58.29,16.46 58.06,16.23 58.06,14.86 T5_M0.2
  Bottom 0.254: v58.29,16.46 40.01,34.75 24,34.75 TILE_MAG0.5
T5_M1  (via drill 0.61)
  Top 0.254: v78.18,14.63 77.27,14.63 T5_M1.2
  Bottom 0.254: v78.18,14.63 81.84,14.63 85.04,11.43 90.75,11.43 91.21,10.97 TILE_MAG1.5
T5_M2  (via drill 0.61)
  Top 0.254: v103.78,4.34 90.3,17.83 89.38,17.83 84.35,12.8 74.52,12.8 73.84,13.49 73.84,13.72 67.67,19.89 67.67,21.03 T5_M2.2
  Bottom 0.254: v103.78,4.34 129.16,4.34 148.59,23.77 153.85,23.77 157.28,20.34 158.19,20.34 159.11,21.26 159.11,34.06 158.42,34.75 157.5,34.75 TILE_MAG2.5
T6_M0  (via drill 0.61)
  Top 0.254: v102.87,16 101.96,15.09 101.96,14.86 T6_M0.2 | v68.58,37.26 v70.41,35.43
  Bottom 0.254: v102.87,16 102.87,20.12 87.55,35.43 v70.41,35.43 | v68.58,37.26 38.86,37.26 37.49,38.63 24,38.63 TILE_MAG0.2
T6_M1  (via drill 0.61, 0.61 pad 1.02)
  Top 0.254: T6_M1.2 121.61,14.63 121.61,14.29 124.14,14.29 125.09,13.65 v125.09,12.38 | v111.78,13.95 115.57,10.79 v120.02,10.79
  Bottom 0.254: v111.78,13.95 92.81,13.95 92.35,14.4 91.44,14.4 TILE_MAG1.2 | v120.02,10.79 120.97,10.79 121.6,11.11 122.87,12.38 v125.09,12.38
T6_M2  (via drill 0.61)
  Top 0.254: v113.16,21.26 112.24,21.26 T6_M2.2
  Bottom 0.254: v113.16,21.26 125.5,21.26 138.53,34.29 154.08,34.29 155.22,35.43 155.22,37.49 156.36,38.63 157.28,38.63 TILE_MAG2.2
T7_M0  (via drill 0.61, 0.61 pad 1.02)
  Top 0.254: v70.41,36.8 69.04,38.18 58.29,38.18 49.84,29.72 48.46,29.72 42.52,35.66 v38.41,35.66 | T7_M0.2 146.99,14.63 146.99,13.72 144.46,11.43 133.99,11.43 v130.81,14.61 | v127.64,18.41 127.64,24.77 v129.84,26.98
  Bottom 0.254: v129.84,26.98 96.7,26.98 86.87,36.8 v70.41,36.8 | v38.41,35.66 24.46,35.66 24,36.12 TILE_MAG0.4 | v130.81,14.61 v127.64,18.41
T7_M1  (via drill 0.61)
  Top 0.254: T7_M1.2 166.19,14.63 166.19,13.03 165.51,12.34 164.78,11.75 162.56,10.16 124.46,10.16 122.87,11.75 118.43,11.75 v115.9,12.34
  Bottom 0.254: v115.9,12.34 91.67,12.34 91.44,12.12 TILE_MAG1.4
T7_M2  (via drill 0.61)
  Top 0.254: v157.73,21.26 156.59,21.26 T7_M2.2
  Bottom 0.254: v157.73,21.26 155.68,23.32 155.68,35.43 156.36,36.12 157.28,36.12 TILE_MAG2.4
TILE_SEL_0  (via drill 0.61)
  Top 0.254: v28.57,25.15 v21.26,32.46 | v109.73,7.09 v111.56,5.26
  Bottom 0.254: v21.26,32.46 20.12,33.6 19.2,33.6 TILE_MAG0.11 | v28.57,25.15 28.57,18.06 27.66,17.14 27.66,9.6 | 27.66,9.6 27.66,6.63 X1.8 | 27.66,9.6 86.41,9.6 TILE_MAG1.11 86.64,9.37 87.55,9.37 88.24,8.69 88.24,8 90.07,6.17 92.58,6.17 93.5,7.09 v109.73,7.09 | v111.56,5.26 129.39,5.26 154.76,30.63 154.76,32.23 153.39,33.6 152.71,33.6 TILE_MAG2.11
TILE_SEL_1  (via drill 0.61)
  Top 0.254: v17.14,16 26.29,6.86 26.29,6.63 26.52,6.4 26.52,5.26 X1.7 | v111.1,7.54 v112.47,6.17
  Bottom 0.254: X1.7 26.75,5.03 28.57,3.2 29.72,3.2 34.75,8.23 86.41,8.23 TILE_MAG1.10 86.64,8.23 87.33,8.23 89.84,5.71 109.73,5.71 111.1,7.09 v111.1,7.54 | v17.14,16 19.2,18.06 19.2,22.86 17.6,24.46 17.6,31.77 18.06,32.23 18.97,32.23 TILE_MAG0.10 | v112.47,6.17 129.62,6.17 154.31,30.86 154.31,31.55 153.62,32.23 152.71,32.23 TILE_MAG2.10
TILE_SEL_2
  Bottom 0.254: TILE_MAG0.9 19.2,31.09 19.2,23.55 19.66,23.09 19.66,17.14 15.32,12.8 15.32,3.89 16,3.2 22.17,3.2 24,5.03 X1.6 24.23,5.03 26.52,2.74 29.95,2.74 34.06,6.86 86.41,6.86 TILE_MAG1.9 86.64,6.86 88.24,5.26 89.55,5.35 89.65,5.26 110,5.26 111.72,6.98 111.76,6.99 118.75,9.53 118.75,14.61 126.36,18.41 126.36,20.32 127,20.95 135.89,30.47 136.65,30.45 151.84,30.45 TILE_MAG2.9
VCC  (via drill 0.61, 0.61 pad 1.02)
  Top 0.254: T7_M2.1 154.74,21.16 155.57,20.32 v155.57,19.68 | T2_M1.1 118.86,45.72 117.47,45.72 115.9,47.3 v115.9,47.55 115.53,47.55 T2_M2.1 | v139.06,44.45 144.78,44.45 v145.73,44.77 | T1_M2.1 65.84,52.91 v66.67,51.44 | v73.66,45.72 74.41,45.72 T1_M1.1 | T2_M0.1 100.65,46.04 v99.69,45.09 | v12.06,44.45 12.06,46.24 T0_M0.1 | T5_M1.1 75.36,14.81 76.83,13.34 81.92,13.34 v85.72,17.14 | v71.55,21.49 81.38,21.49 v85.72,17.14 | T5_M2.1 65.72,20.64 58.42,13.34 55.88,13.34 v54.61,13.65 55.88,13.97 56.2,14.29 T5_M0.1 | v120.65,13.34 T6_M1.1 117.79,13.65 114.94,13.65 v114.94,13.97 | v134.62,13.34 138.43,13.34 139.7,12.06 140.97,12.06 v142.24,13.34 | T7_M0.1 143.94,13.65 v143.83,13.65 | 159.7,40.96 v161.29,39.37 | 159.7,40.96 158.75,41.91 v153.03,41.91 | T3_M1.1 159.7,42.11 159.7,40.96 | T3_M2.1 152.52,50.8 v152.4,50.8 | T7_M1.1 162.68,13.34 v159.38,13.34 | v31.75,13.34 30.8,14.29 T4_M1.1 | v30.48,20.32 v27.3,20.32 | v22.86,18.41 22.75,18.41 22.17,18.99 | 22.17,18.99 T4_M2.1 | v17.78,18.41 21.59,18.41 22.17,18.99 | v29.21,45.72 29.96,45.72 T0_M1.1 | v10.79,12.7 11.43,12.7 11.43,14.49 T4_M0.1 | v85.72,17.14 87.63,19.05 88.27,19.37 v93.34,19.37 | v62.87,24.13 63.5,24.77 v67.94,24.77 | T1_M0.1 56.2,47.3 v55.24,48.26
  Bottom 0.254: 70,25.55 68.12,27.43 68.12,32.46 67.21,32.46 MAG_MUX.8 67.21,33.6 C4.1 67.44,33.83 69.49,35.89 69.49,47.09 | 70,25.55 71.55,24 v71.55,21.49 71.55,16.69 72.92,15.32 C22.1 | 55.24,47.09 57.38,47.09 63.32,53.03 C9.1 63.55,53.03 66.23,50.35 | 55.24,47.09 54.18,47.09 C8.1 | 69.49,47.09 72.92,47.09 C10.1 73.03,46.35 v73.66,45.72 | 66.23,50.35 69.49,47.09 | 34.29,15.32 53.95,15.32 C20.1 | 34.29,15.32 v29.72,15.32 28.57,15.32 C19.1 30.39,13.34 v31.75,13.34 | C21.1 63.32,21.49 63.32,20.12 58.52,15.32 54.18,15.32 C20.1 | 24.69,47.55 19.2,53.03 C6.1 | 24.69,47.55 25.15,47.09 28.57,47.09 C7.1 28.57,46.35 v29.21,45.72 | 10.78,43.17 9.6,44.35 9.6,46.86 C5.1 | 24.69,47.55 18.97,41.83 18.97,40.01 | 18.97,40.01 TILE_MAG0.16 | 151.8,40.68 152.48,40.01 TILE_MAG2.16 | 151.8,40.68 151.33,41.15 150.65,41.15 C2.1 150.42,41.38 v147.68,44.12 146.06,45.73 | 146.06,45.73 145.85,45.95 | 145.85,45.95 144.93,46.86 143.56,46.86 C14.1 | 150.6,50.7 145.85,45.95 | 150.6,50.7 152.93,53.03 C15.1 153.16,53.03 159.11,47.09 162.53,47.09 C16.1 | 107.9,19.66 103.33,15.09 v98.98,15.09 97.84,15.09 C23.1 97.7,15.15 97.16,14.61 94.61,14.61 93.34,15.88 v93.34,19.37 | 107.9,19.66 107.9,21.49 C24.1 | 114.94,15.32 112.24,15.32 107.9,19.66 | 114.94,15.32 117.27,15.32 C25.1 | 108.58,53.03 102.64,47.09 99.21,47.09 C11.1 98.42,46.27 98.42,45.72 99.06,45.09 v99.69,45.09 | 114.3,47.55 114.07,47.55 108.58,53.03 | 114.3,47.55 v115.9,47.55 117.96,47.55 C13.1 | 108.58,53.03 C12.1 | 158.65,14.68 161.85,15.32 C28.1 | 154.93,18.4 152.48,20.85 C27.1 152.25,21.49 146.07,15.32 v144.02,15.32 142.88,15.32 C26.1 142.88,13.97 | 154.93,18.4 156.2,17.13
  Bottom 0.254: 156.2,17.13 158.65,14.68 | 85.5,16.92 84.58,16.92 C3.1 | 85.5,16.92 86.41,16 TILE_MAG1.16 | 9.6,13.89 9.6,7.09 11.43,5.26 X1.1 | 9.6,13.89 9.6,15.09 C17.1 9.6,15.32 15.09,20.8 15.88,20.8 | 15.9,21.02 15.88,20.8 | 15.9,21.02 16,22.07 14.61,23.47 C1.1 | 18.29,20.8 C18.1 16.05,20.87 15.9,21.02 | v85.72,17.14 85.5,16.92 | 154.93,18.4 155.57,19.05 v155.57,19.68 | 114.3,47.55 114.3,46.35 116.2,44.45 v139.06,44.45 | v145.73,44.77 146.06,45.73 | v66.67,51.44 66.23,50.35 | 10.78,43.17 v12.06,44.45 | C20.1 54.06,15.15 v54.61,13.65 | 142.88,13.97 v142.24,13.34 | v143.83,13.65 142.88,13.97 | 156.2,17.13 160.02,20.95 160.02,26.04 161.29,27.3 v161.29,39.37 | v153.03,41.91 151.8,40.68 | v152.4,50.8 152.3,50.7 150.6,50.7 | v159.38,13.34 158.65,14.07 158.65,14.68 | 34.29,15.32 34.29,18.41 32.38,20.32 v30.48,20.32 | v27.3,20.32 24.77,20.32 v22.86,18.41 | 15.88,20.8 15.88,20.32 v17.78,18.41 | 9.6,13.89 v10.79,12.7 | 62.88,19.67 62.23,20.32 62.23,23.5 v62.87,24.13 | v67.94,24.77 69.22,24.77 70,25.55 | C1.1 12.15,38.01 11.43,38.73 11.43,42.52 10.78,43.17 | C1.1 14.61,38.1 16.51,40.01 18.97,40.01 | v120.65,13.34 v134.62,13.34 | 114.94,15.32 v114.94,13.97 | v55.24,48.26 55.24,47.09
  pour Top (isolate 0.305): 1.59,1.59 1.59,61.91 176.21,61.91 176.21,1.59

### Text on the board
tPlace: "AND-y & NOT-asha Gates" | Cal Poly CPE: "Logic Tiles" / 4x2 Tile Module r1 / AW & TL